# Altium schematic sheet Sheet2.SchDoc
size A4; SheetNumber: 2; SheetTotal: 2
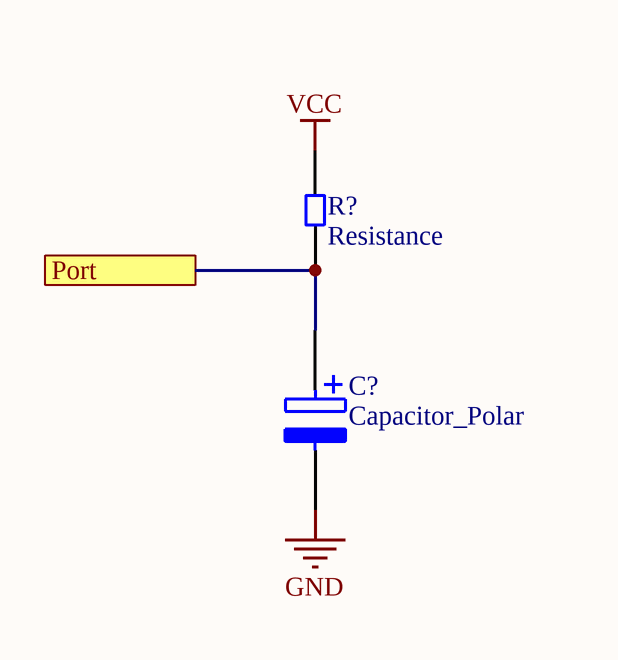
[diagram p0: Sheet2.SchDoc]

## Parts
C?  Capacitor_Polar  [CAP_TANT_CASE_B]
R?  Resistance  [RES_0805]

## Ports
Port

## Nets
GND: C?.2
VCC: R?.2
Port: C?.1 R?.1 ; port Port

## Library data of the parts
R? = Resistor